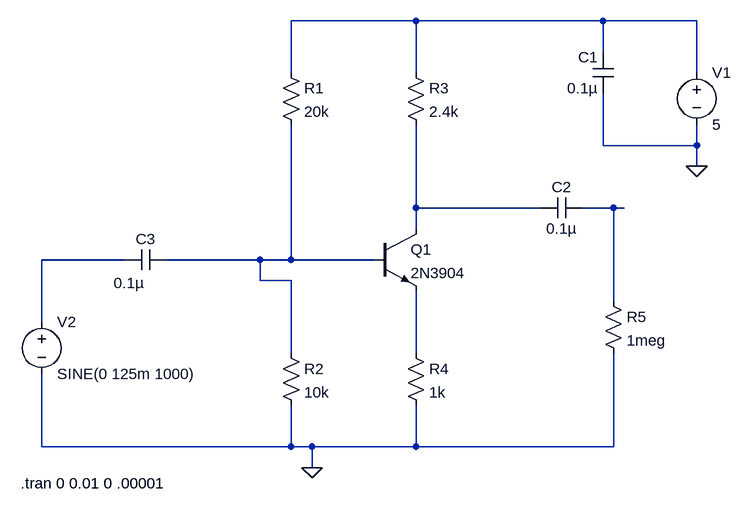
[diagram p0: schematic Verify.asc]
Verify.asc, the LTspice schematic file:
Version 4
SHEET 1 880 680
WIRE 272 -128 80 -128
WIRE 560 -128 272 -128
WIRE 704 -128 560 -128
WIRE 560 -80 560 -128
WIRE 80 -48 80 -128
WIRE 272 -48 272 -128
WIRE 704 -48 704 -128
WIRE 560 64 560 -16
WIRE 704 64 704 32
WIRE 704 64 560 64
WIRE 704 96 704 64
WIRE 272 160 272 32
WIRE 464 160 272 160
WIRE 576 160 528 160
WIRE 592 160 576 160
WIRE 272 192 272 160
WIRE -176 240 -304 240
WIRE 32 240 -112 240
WIRE 80 240 80 32
WIRE 80 240 32 240
WIRE 208 240 80 240
WIRE 32 272 32 240
WIRE 80 272 32 272
WIRE 576 304 576 160
WIRE -304 336 -304 240
WIRE 80 384 80 272
WIRE 272 384 272 288
WIRE -304 528 -304 416
WIRE 80 528 80 464
WIRE 80 528 -304 528
WIRE 112 528 80 528
WIRE 272 528 272 464
WIRE 272 528 112 528
WIRE 576 528 576 384
WIRE 576 528 272 528
WIRE 112 560 112 528
FLAG 112 560 0
FLAG 704 96 0
SYMBOL cap 528 144 R90
WINDOW 0 0 32 VBottom 2
WINDOW 3 32 32 VTop 2
SYMATTR InstName C2
SYMATTR Value 0.1µ
SYMBOL cap -112 224 R90
WINDOW 0 0 32 VBottom 2
WINDOW 3 36 57 VTop 2
SYMATTR InstName C3
SYMATTR Value 0.1µ
SYMBOL res 64 -64 R0
SYMATTR InstName R1
SYMATTR Value 20k
SYMBOL res 64 368 R0
SYMATTR InstName R2
SYMATTR Value 10k
SYMBOL npn 208 192 R0
SYMATTR InstName Q1
SYMATTR Value 2N3904
SYMBOL res 256 -64 R0
SYMATTR InstName R3
SYMATTR Value 2.4k
SYMBOL res 256 368 R0
SYMATTR InstName R4
SYMATTR Value 1k
SYMBOL voltage 704 -64 R0
WINDOW 123 0 0 Left 2
WINDOW 39 0 0 Left 2
SYMATTR InstName V1
SYMATTR Value 5
SYMBOL voltage -304 320 R0
WINDOW 123 0 0 Left 2
WINDOW 39 0 0 Left 2
SYMATTR InstName V2
SYMATTR Value SINE(0 125m 1000)
SYMBOL res 560 288 R0
SYMATTR InstName R5
SYMATTR Value 1meg
SYMBOL cap 576 -16 R180
WINDOW 0 24 56 Left 2
WINDOW 3 24 8 Left 2
SYMATTR InstName C1
SYMATTR Value 0.1µ
TEXT -336 584 Left 2 !.tran 0 0.01 0 .00001

The netlist it stands for:
* Verify.asc
C2 N003 N002 0.1µ
C3 N005 N004 0.1µ
R1 N001 N005 20k
R2 N005 0 10k
Q1 N002 N005 N006 0 2N3904
R3 N001 N002 2.4k
R4 N006 0 1k
V1 N001 0 5
V2 N004 0 SINE(0 125m 1000)
R5 N003 0 1meg
C1 0 N001 0.1µ
.model NPN NPN
.model PNP PNP
.lib standard.bjt
.tran 0 0.01 0 .00001
.backanno
.end